# EAGLE design upper_pcb (EAGLE 9.6.2)
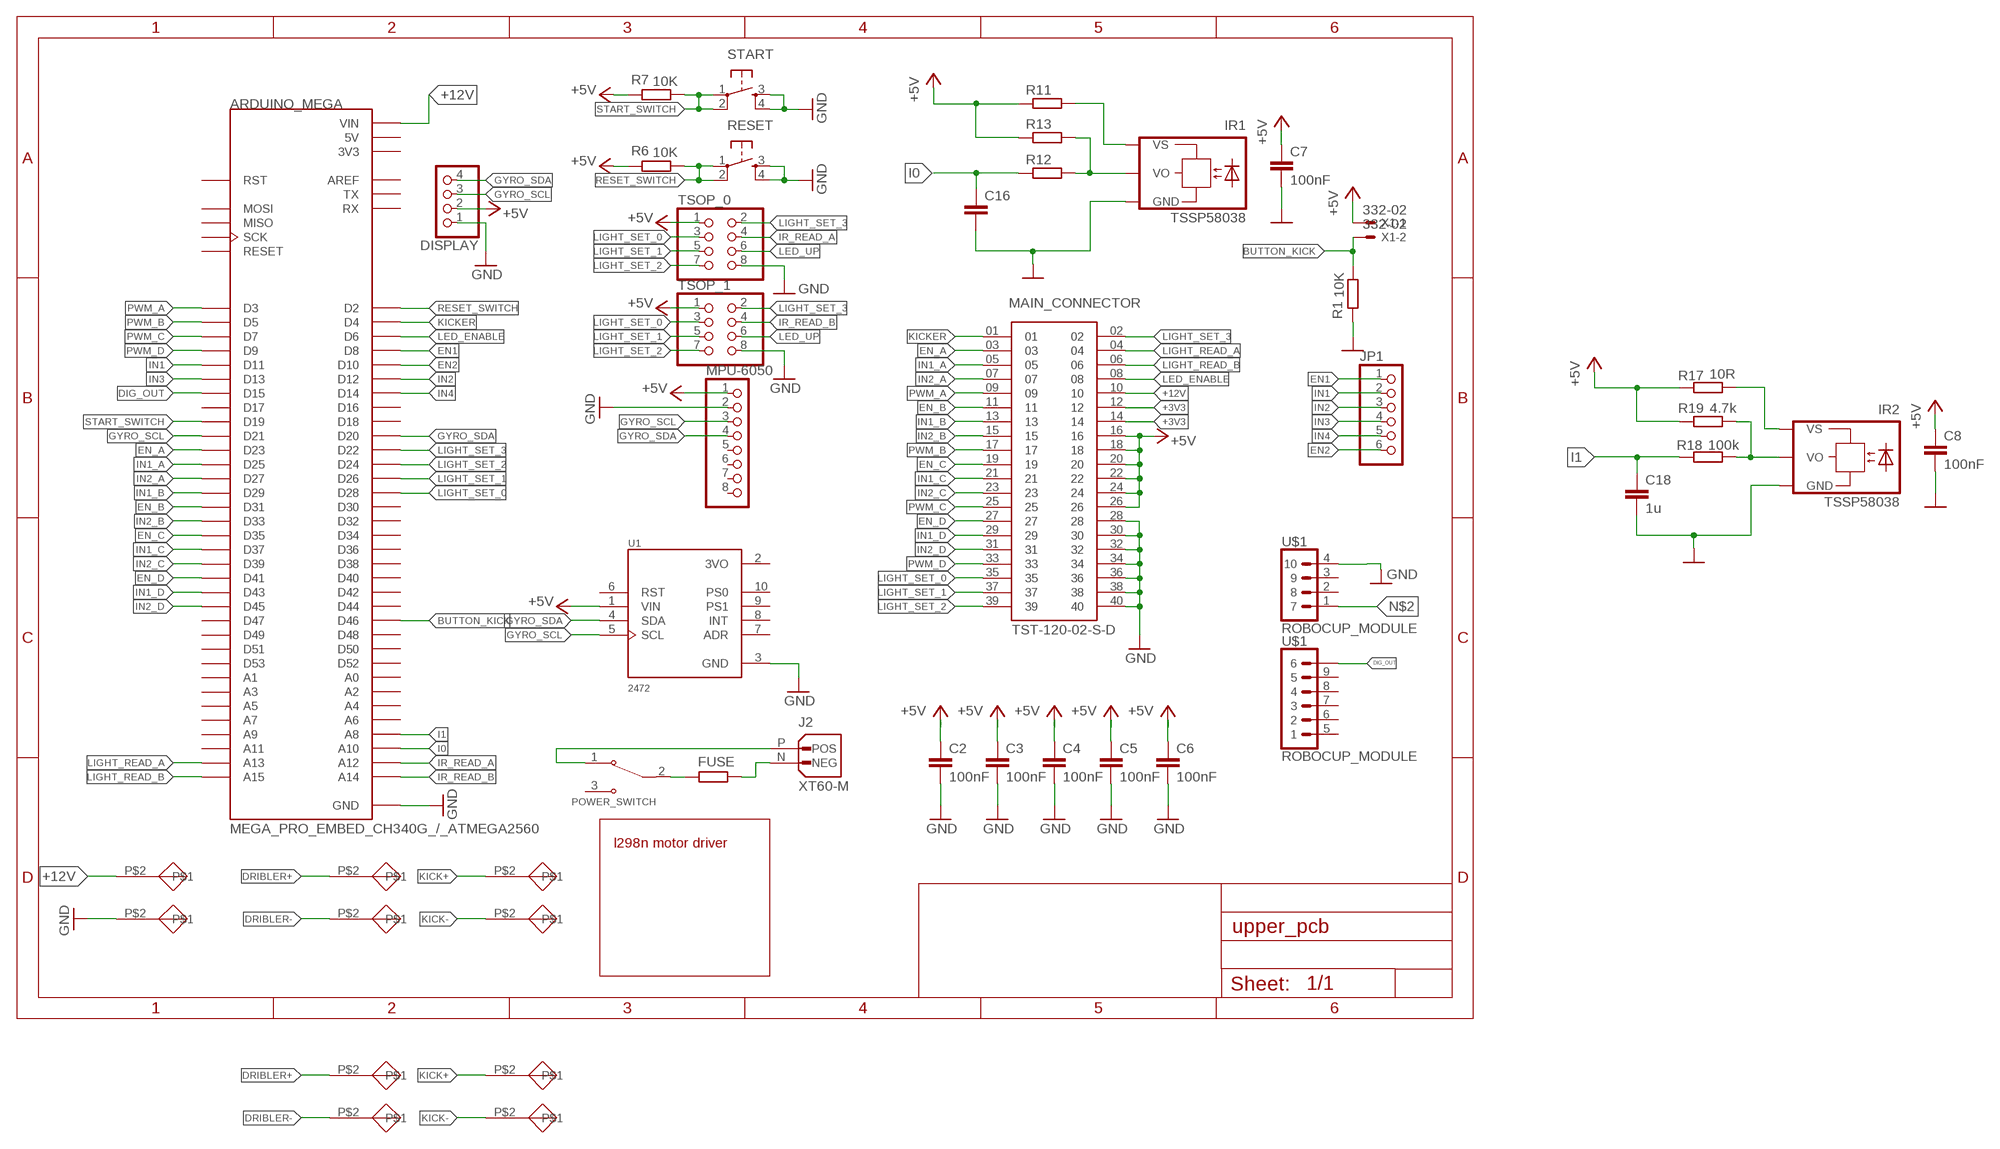
[diagram p0: schematic, sheet 1]

## Parts
ARDUINO_MEGA  MEGA_PRO_EMBED_CH340G_/_ATMEGA2560  [MODULE_MEGA_PRO_EMBED_CH340G_/_ATMEGA2560]
C2  100nF  C-EUC0805  [C0805]
C3  100nF  C-EUC0805  [C0805]
C4  100nF  C-EUC0805  [C0805]
C5  100nF  C-EUC0805  [C0805]
C6  100nF  C-EUC0805  [C0805]
C7  100nF  C-EUC0805  [C0805]
C8  100nF  C-EUC0805  [C0805]
C16  C-EUC0805  [C0805]
C18  1u  C-EUC0805  [C0805]
DISPLAY  PINHD-1X4  [1X04]
FUSE  R-EU_R1206  [R1206]
IR1  TSSP58038  TSOP4038  [TSOP]
IR2  TSSP58038  TSOP4038  [TSOP]
J2  XT60-M  [AMASS_XT60-M]
JP1  PINHD-1X6  [1X06]
MAIN_CONNECTOR  TST-120-02-S-D  [SAMTEC_TST-120-02-S-D]
MPU-6050  PINHD-1X8  [1X08]
POWER_SWITCH  100SP1T1B4M2QE  [SW_100SP1T1B4M2QE]
R1  10K  R-EU_R1206  [R1206]
R6  10K  R-EU_R1206  [R1206]
R7  10K  R-EU_R1206  [R1206]
R11  R-EU_R0805  [R0805]
R12  R-EU_R0805  [R0805]
R13  R-EU_R0805  [R0805]
R17  10R  R-EU_R0805  [R0805]
R18  100k  R-EU_R0805  [R0805]
R19  4.7k  R-EU_R0805  [R0805]
RESET  DTSM-6  [DTSM-6]
START  DTSM-6  [DTSM-6]
TSOP_0  PINHD-2X4  [2X04]
TSOP_1  PINHD-2X4  [2X04]
U1  2472  [MODULE_2472]
U$1  ROBOCUP_MODULE  [ROBOCUP_MODULE]
U$2  L298NMOTORDRIVER  [L298NMOTORDRIVER]
U$3  PAD_MOTORS  [PAD_MOTORS]
U$4  PAD_MOTORS  [PAD_MOTORS]
U$5  PAD_MOTORS  [PAD_MOTORS]
U$6  PAD_MOTORS  [PAD_MOTORS]
U$7  PAD_MOTORS  [PAD_MOTORS]
U$8  PAD_MOTORS  [PAD_MOTORS]
U$9  PAD_MOTORS  [PAD_MOTORS]
U$10  PAD_MOTORS  [PAD_MOTORS]
U$11  PAD_MOTORS  [PAD_MOTORS]
U$12  PAD_MOTORS  [PAD_MOTORS]
X1  332-02  [332-02]

## Nets
+3V3: MAIN_CONNECTOR.12 MAIN_CONNECTOR.14
+5V: C2.1 C3.1 C4.1 C5.1 C6.1 C7.1 C8.1 DISPLAY.2 MAIN_CONNECTOR.16 MAIN_CONNECTOR.18 MAIN_CONNECTOR.20 MAIN_CONNECTOR.22 MAIN_CONNECTOR.24 MAIN_CONNECTOR.26 MPU-6050.1 R6.2 R7.2 R11.1 R13.1 R17.1 R19.1 TSOP_0.1 TSOP_1.1 U1.1(VIN) X1.1
+12V: ARDUINO_MEGA.VIN_1(VIN) ARDUINO_MEGA.VIN_2(VIN) MAIN_CONNECTOR.10 U$7.P$2
BUTTON_KICK: ARDUINO_MEGA.D46 R1.1 X1.2
DIG_OUT: ARDUINO_MEGA.D15 U$1.10
DRIBLER+: U$5.P$2 U$11.P$2
DRIBLER-: U$6.P$2 U$12.P$2
EN1: ARDUINO_MEGA.D8 JP1.1
EN2: ARDUINO_MEGA.D10 JP1.6
EN_A: ARDUINO_MEGA.D23 MAIN_CONNECTOR.03
EN_B: ARDUINO_MEGA.D31 MAIN_CONNECTOR.11
EN_C: ARDUINO_MEGA.D35 MAIN_CONNECTOR.19
EN_D: ARDUINO_MEGA.D41 MAIN_CONNECTOR.27
GND: ARDUINO_MEGA.GND_1(GND) ARDUINO_MEGA.GND_2(GND) ARDUINO_MEGA.GND_3(GND) C2.2 C3.2 C4.2 C5.2 C6.2 C7.2 C8.2 C16.2 C18.2 DISPLAY.1 IR1.GND IR2.GND MAIN_CONNECTOR.28 MAIN_CONNECTOR.30 MAIN_CONNECTOR.32 MAIN_CONNECTOR.34 MAIN_CONNECTOR.36 MAIN_CONNECTOR.38 MAIN_CONNECTOR.40 MPU-6050.2 R1.2 RESET.3 RESET.4 START.3 START.4 TSOP_0.8 TSOP_1.8 U1.3(GND) U$1.4 U$8.P$2
GYRO_SCL: ARDUINO_MEGA.D21 DISPLAY.3 MPU-6050.3 U1.5(SCL)
GYRO_SDA: ARDUINO_MEGA.D20 DISPLAY.4 MPU-6050.4 U1.4(SDA)
I0: ARDUINO_MEGA.A10 C16.1 R12.1
I1: ARDUINO_MEGA.A8 C18.1 R18.1
IN1: ARDUINO_MEGA.D11 JP1.2
IN1_A: ARDUINO_MEGA.D25 MAIN_CONNECTOR.05
IN1_B: ARDUINO_MEGA.D29 MAIN_CONNECTOR.13
IN1_C: ARDUINO_MEGA.D37 MAIN_CONNECTOR.21
IN1_D: ARDUINO_MEGA.D43 MAIN_CONNECTOR.29
IN2: ARDUINO_MEGA.D12 JP1.3
IN2_A: ARDUINO_MEGA.D27 MAIN_CONNECTOR.07
IN2_B: ARDUINO_MEGA.D33 MAIN_CONNECTOR.15
IN2_C: ARDUINO_MEGA.D39 MAIN_CONNECTOR.23
IN2_D: ARDUINO_MEGA.D45 MAIN_CONNECTOR.31
IN3: ARDUINO_MEGA.D13 JP1.4
IN4: ARDUINO_MEGA.D14 JP1.5
IR_READ_A: ARDUINO_MEGA.A12 TSOP_0.4
IR_READ_B: ARDUINO_MEGA.A14 TSOP_1.4
KICK+: U$3.P$2 U$9.P$2
KICK-: U$4.P$2 U$10.P$2
KICKER: ARDUINO_MEGA.D4 MAIN_CONNECTOR.01
LED_ENABLE: ARDUINO_MEGA.D6 MAIN_CONNECTOR.08
LED_UP: TSOP_0.6 TSOP_1.6
LIGHT_READ_A: ARDUINO_MEGA.A13 MAIN_CONNECTOR.04
LIGHT_READ_B: ARDUINO_MEGA.A15 MAIN_CONNECTOR.06
LIGHT_SET_0: ARDUINO_MEGA.D28 MAIN_CONNECTOR.35 TSOP_0.3 TSOP_1.3
LIGHT_SET_1: ARDUINO_MEGA.D26 MAIN_CONNECTOR.37 TSOP_0.5 TSOP_1.5
LIGHT_SET_2: ARDUINO_MEGA.D24 MAIN_CONNECTOR.39 TSOP_0.7 TSOP_1.7
LIGHT_SET_3: ARDUINO_MEGA.D22 MAIN_CONNECTOR.02 TSOP_0.2 TSOP_1.2
N$1: FUSE.2 POWER_SWITCH.2
N$2: J2.P(POS) POWER_SWITCH.1 U$1.1
N$3: FUSE.1 J2.N(NEG)
N$9: IR1.VS R11.2
N$11: IR2.VS R17.2
N$23: IR1.VO R12.2 R13.2
N$27: IR2.VO R18.2 R19.2
PWM_A: ARDUINO_MEGA.D3 MAIN_CONNECTOR.09
PWM_B: ARDUINO_MEGA.D5 MAIN_CONNECTOR.17
PWM_C: ARDUINO_MEGA.D7 MAIN_CONNECTOR.25
PWM_D: ARDUINO_MEGA.D9 MAIN_CONNECTOR.33
RESET_SWITCH: ARDUINO_MEGA.D2 R6.1 RESET.1 RESET.2
START_SWITCH: ARDUINO_MEGA.D19 R7.1 START.1 START.2
Unconnected: ARDUINO_MEGA.A0 ARDUINO_MEGA.A1 ARDUINO_MEGA.A2 ARDUINO_MEGA.A3 ARDUINO_MEGA.A4 ARDUINO_MEGA.A5 ARDUINO_MEGA.A6 ARDUINO_MEGA.A7 ARDUINO_MEGA.A9 ARDUINO_MEGA.A11 ARDUINO_MEGA.AREF ARDUINO_MEGA.D16 ARDUINO_MEGA.D17 ARDUINO_MEGA.D18 ARDUINO_MEGA.D30 ARDUINO_MEGA.D32 ARDUINO_MEGA.D34 ARDUINO_MEGA.D36 ARDUINO_MEGA.D38 ARDUINO_MEGA.D40 ARDUINO_MEGA.D42 ARDUINO_MEGA.D44 ARDUINO_MEGA.D47 ARDUINO_MEGA.D48 ARDUINO_MEGA.D49 ARDUINO_MEGA.D50 ARDUINO_MEGA.D51 ARDUINO_MEGA.D52 ARDUINO_MEGA.D53 ARDUINO_MEGA.MISO ARDUINO_MEGA.MOSI ARDUINO_MEGA.RESET ARDUINO_MEGA.RST ARDUINO_MEGA.RX ARDUINO_MEGA.SCK ARDUINO_MEGA.TX MPU-6050.5 MPU-6050.6 MPU-6050.7 MPU-6050.8 POWER_SWITCH.3 U1.6(RST) U1.7(ADR) U1.8(INT) U1.9(PS1) U1.10(PS0) U$1.2 U$1.3 U$1.5 U$1.6 U$1.7 U$1.8 U$1.9

## Power pins joined to a net without a drawn wire
3V3: ARDUINO_MEGA.3V3_1(3V3) ARDUINO_MEGA.3V3_2(3V3)
3VO: U1.2(3VO)
5V: ARDUINO_MEGA.5V_1(5V) ARDUINO_MEGA.5V_2(5V) ARDUINO_MEGA.5V_3(5V)

## Library data of the parts
ARDUINO_MEGA = MEGA_PRO_EMBED_CH340G___ATMEGA2560:MEGA_PRO_EMBED_CH340G_/_ATMEGA2560: Mega 2560 PRO (Embed) CH340G/ATmega2560-16AU Check availability <https://pricing.snapeda.com/parts/Mega%20Pro%20Embed%20CH340G%20/%20ATmega2560/Robotdyn/view-part?ref=eda>; AVAILABILITY: Not in stock; MF: Robotdyn; MP: Mega Pro Embed CH340G / ATmega2560; PACKAGE: None; PRICE: None
C2-C8 C16 C18 = rcl:C-EU: CAPACITOR, European symbol; SPICEPREFIX: C
DISPLAY = pinhead:PINHD-1X4: PIN HEADER
FUSE R1 R6 R7 R11-R13 R17-R19 = rcl:R-EU_: RESISTOR, European symbol; SPICEPREFIX: R
IR1 IR2 = TSOP4038:TSOP4038: TSOP4038 IR Receiver Module Source: http://www.vishay.com/docs/81926/tsop4038.pdf Check availability <https://pricing.snapeda.com/parts/TSOP4038/Vishay/view-part?ref=eda>; AVAILABILITY: In Stock; DESCRIPTION: Remote Receiver Sensor, 38.0kHz 30m Through Hole; MF: Vishay; MP: TSOP4038; PACKAGE: None; PRICE: None; PURCHASE-URL: https://pricing.snapeda.com/search/part/TSOP4038/?ref=eda
J2 = XT60-M:XT60-M: Check availability <https://pricing.snapeda.com/parts/XT60-M/AMASS/view-part?ref=eda>; AVAILABILITY: Not in stock; DESCRIPTION: Plug; DC supply; XT60; male; PIN: 2; for cable; soldered; 30A; 500V; MF: AMASS; MP: XT60-M; PACKAGE: Package; PRICE: None
JP1 = adafruit:PINHD-1X6: PIN HEADER
MAIN_CONNECTOR = TST-120-02-S-D:TST-120-02-S-D: Check availability <https://pricing.snapeda.com/parts/TST-120-02-S-D-20/Samtec/view-part?ref=eda>; AVAILABILITY: In Stock; DESCRIPTION: Connector Header Through Hole 40 position 0.100 (2.54mm); MF: Samtec; MP: TST-120-02-S-D-20; PACKAGE: None; PRICE: None; PURCHASE-URL: https://pricing.snapeda.com/search/part/TST-120-02-S-D-20/?ref=eda
MPU-6050 = pinhead:PINHD-1X8: PIN HEADER
POWER_SWITCH = 100SP1T1B4M2QE:100SP1T1B4M2QE: Toggle Switch SPDT Through Hole Check availability <https://pricing.snapeda.com/parts/100SP1T1B4M2QE/E-Switch/view-part?ref=eda>; AVAILABILITY: In Stock; DESCRIPTION: Toggle Switch SPDT Through Hole; MF: E-Switch; MP: 100SP1T1B4M2QE; PACKAGE: None; PRICE: None; PURCHASE-URL: https://pricing.snapeda.com/search/part/100SP1T1B4M2QE/?ref=eda
RESET START = switch-tact:DTSM-6
TSOP_0 TSOP_1 = pinhead:PINHD-2X4: PIN HEADER
U1 = 2472:2472: Check availability <https://pricing.snapeda.com/parts/2472/Adafruit/view-part?ref=eda>; AVAILABILITY: In Stock; CHECK_PRICES: https://www.snapeda.com/parts/2472/Adafruit+Industries/view-part/?ref=eda; DESCRIPTION: Adafruit 9-DOF Absolute Orientation IMU Fusion Breakout - BNO055 | Adafruit Industries 2472; MF: Adafruit; MP: 2472; PACKAGE: Non-Standard Adafruit; PRICE: None; PURCHASE-URL: https://www.snapeda.com/api/url_track_click_mouser/?unipart_id=6348449&manufacturer=Adafruit&part_name=2472&search_term=adafruit 9-dof; SNAPEDA_LINK: https://www.snapeda.com/parts/2472/Adafruit+Industries/view-part/?ref=snap
U$1 = ROBOCUP_MODULE:ROBOCUP_MODULE
U$2 = l298n motor driver:L298NMOTORDRIVER
U$3-U$12 = PAD_MOTORS:PAD_MOTORS
X1 = con-garry:332-02: 2 Pin - 2mm Dual Row Source: www.mpe-connector.de / garry_shortform_2012.pdf

## Board
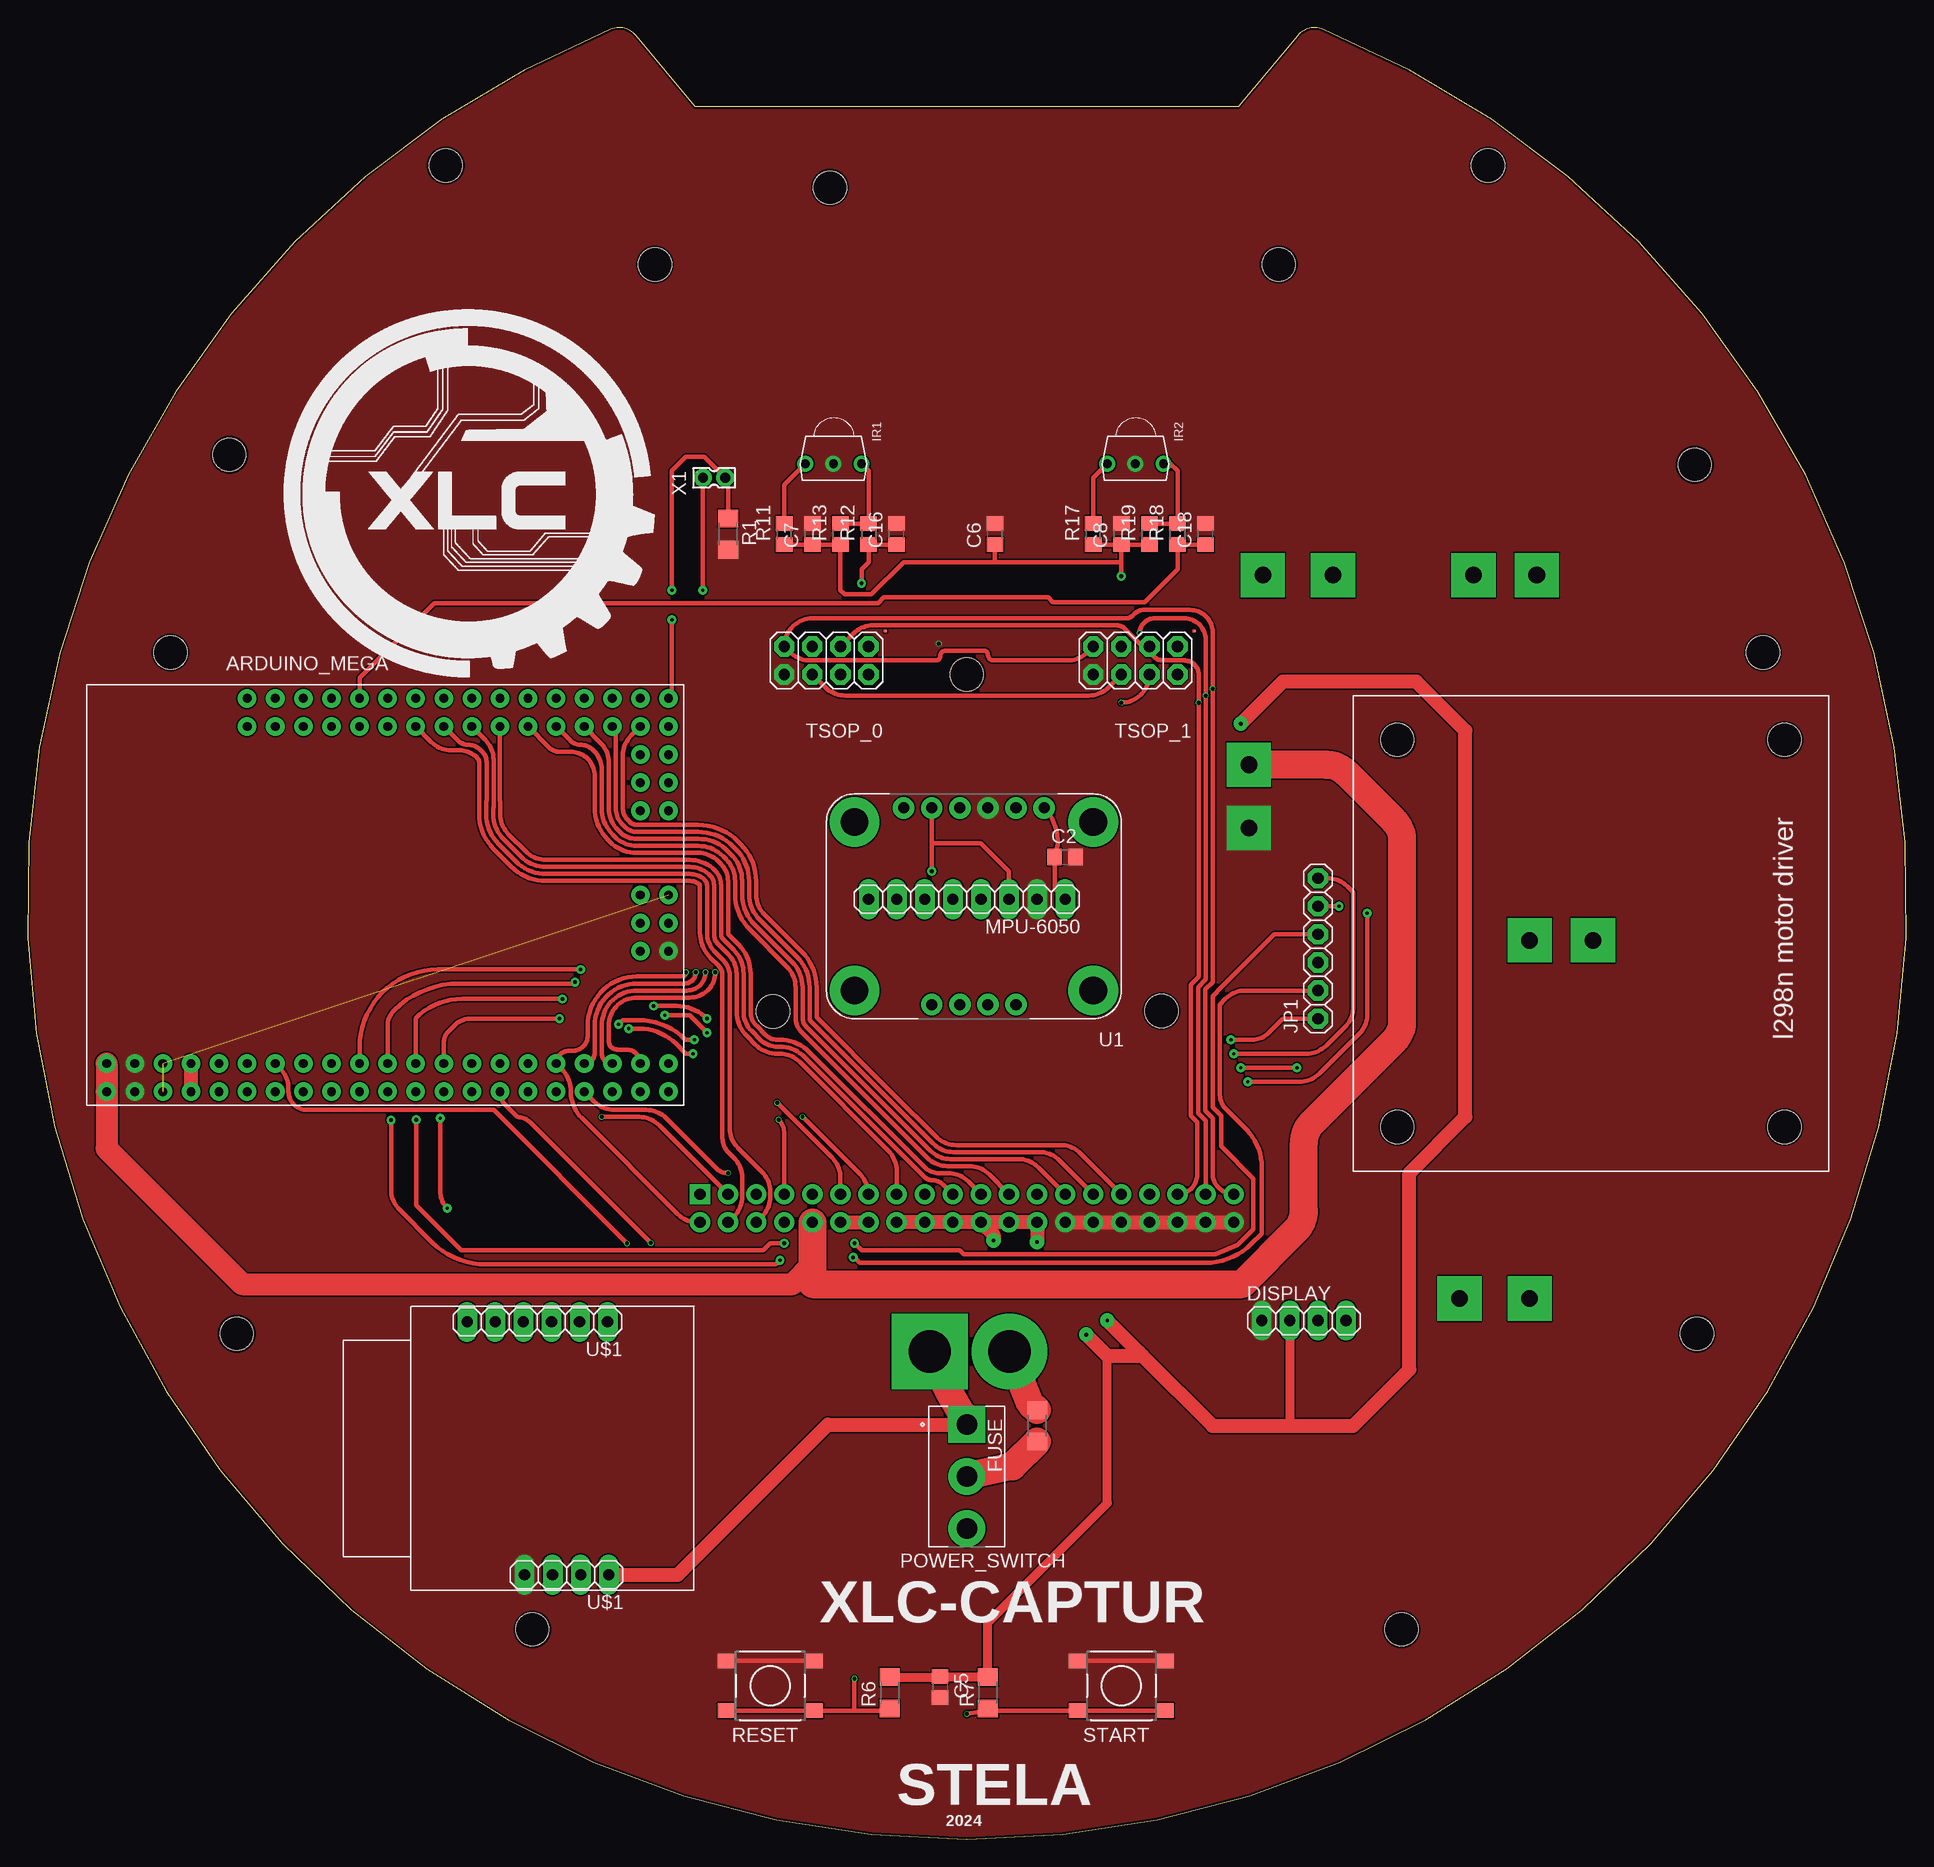
[diagram p1: board, top side]
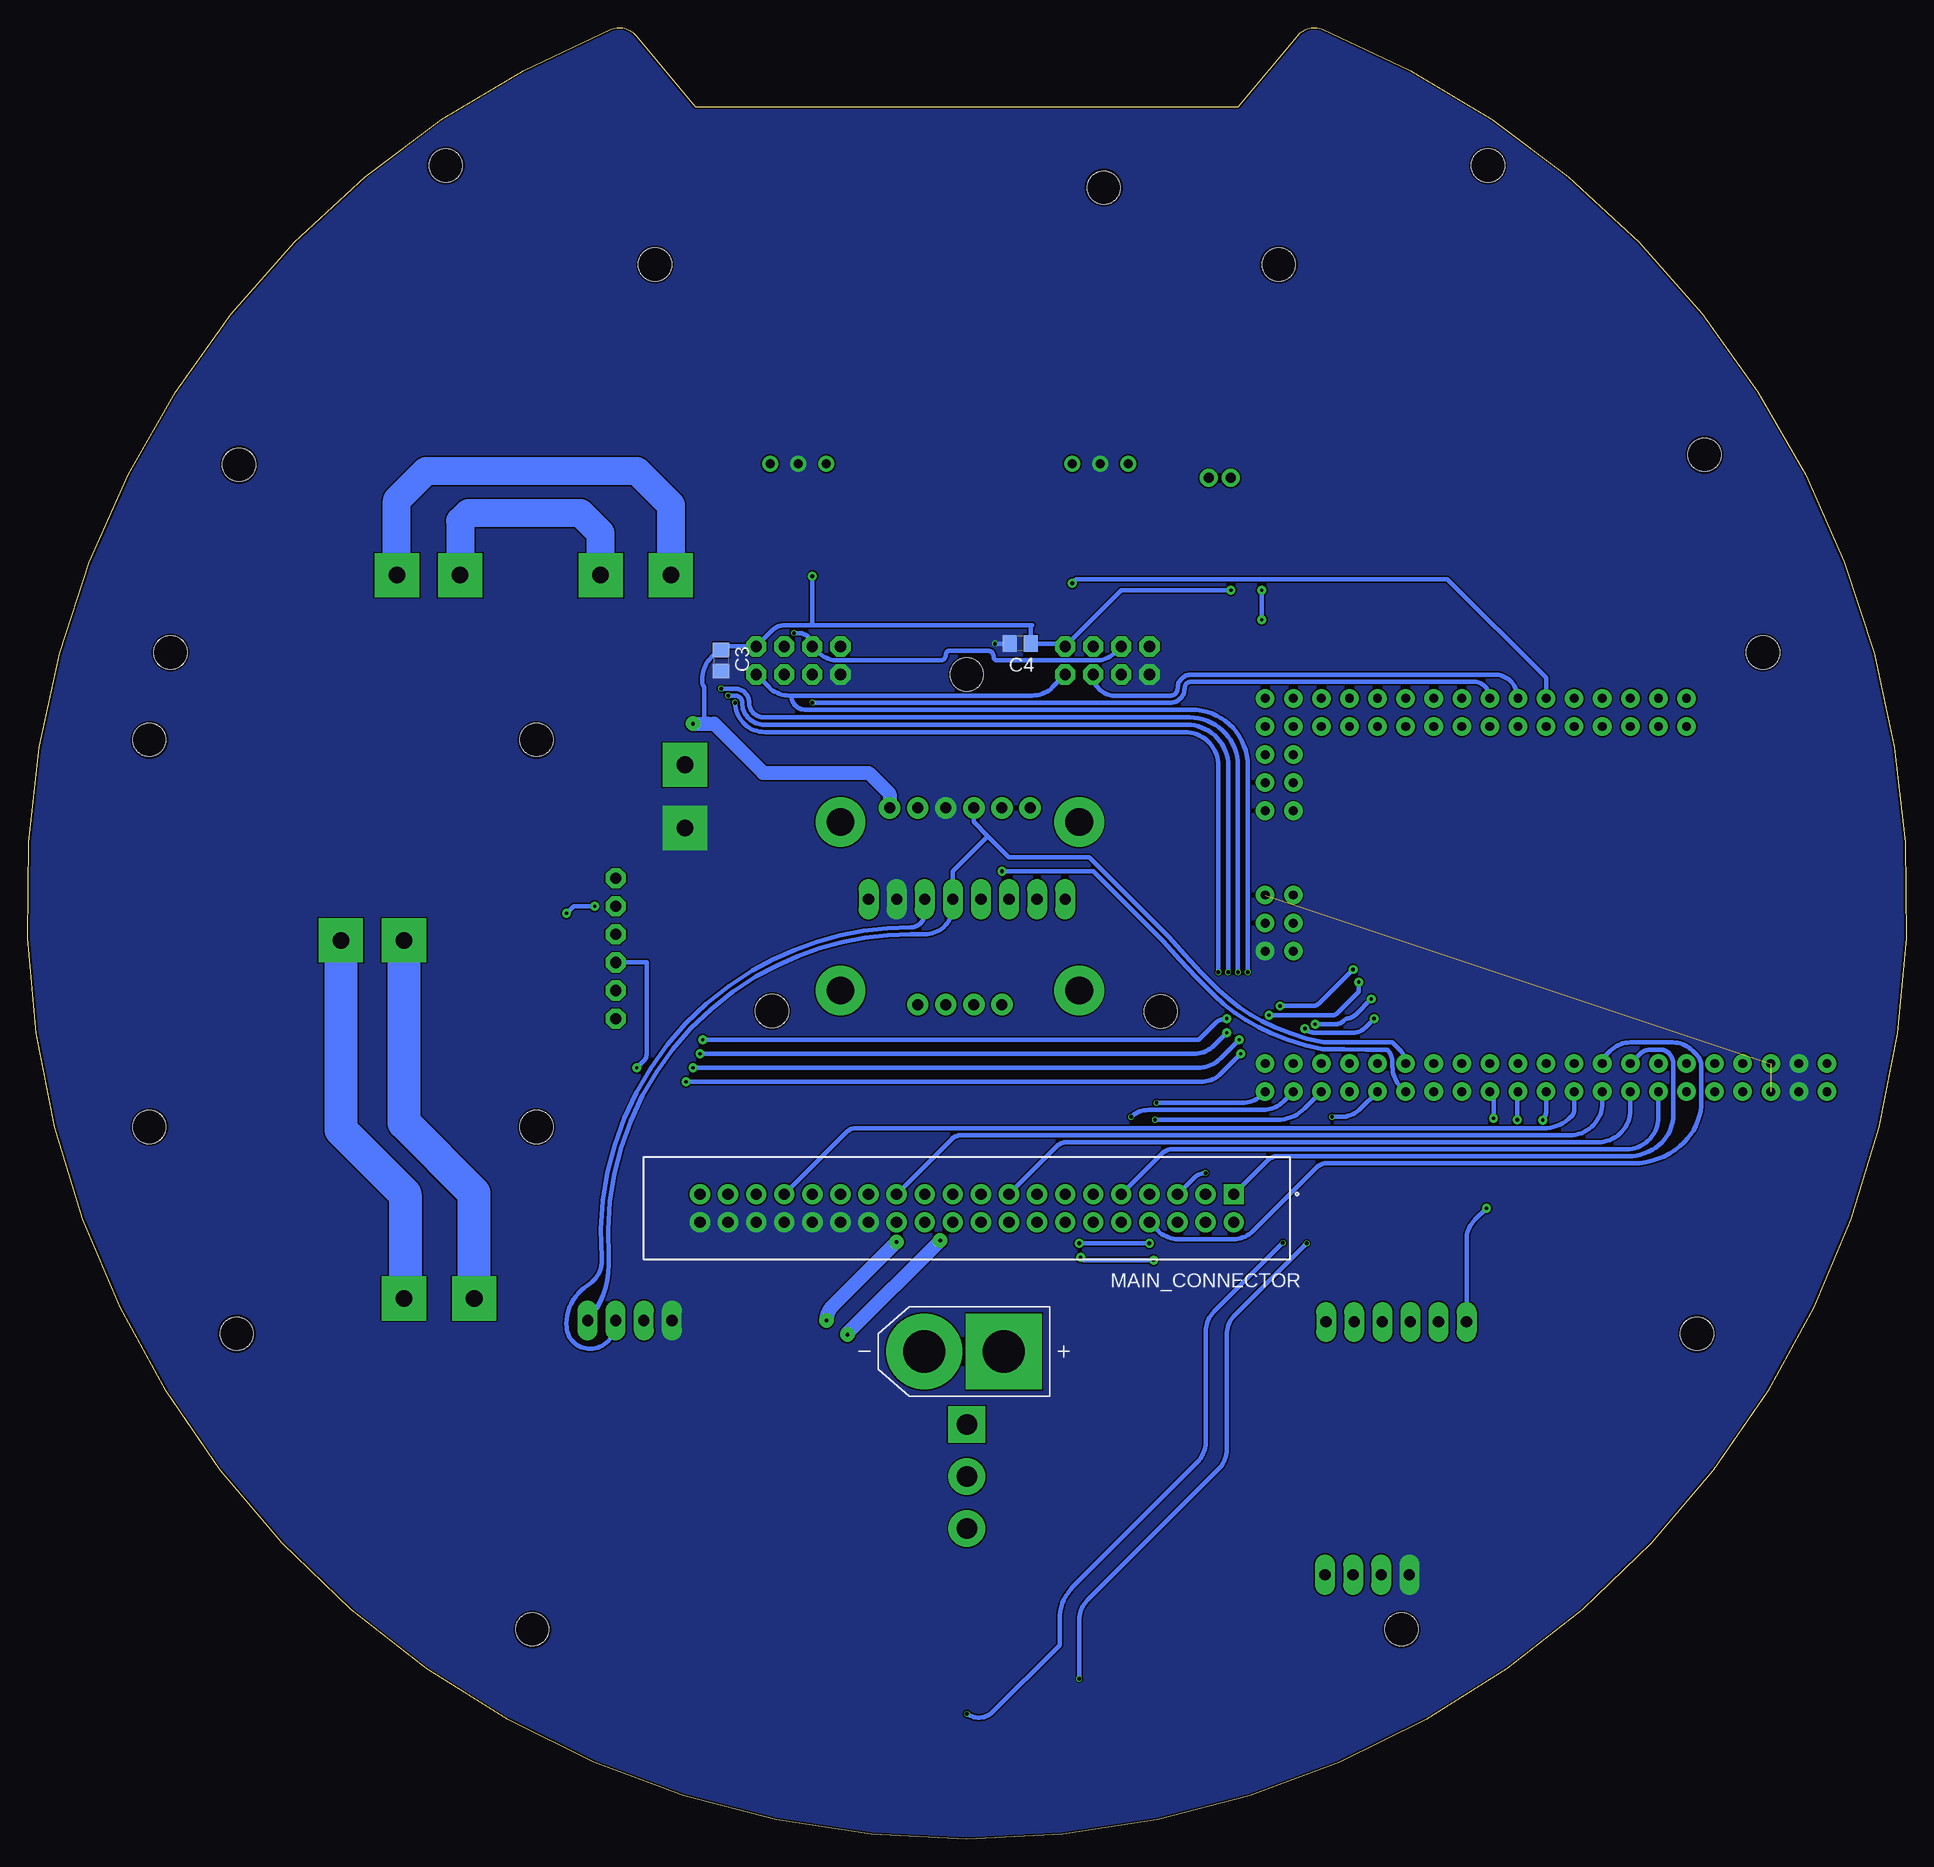
[diagram p2: board, bottom side, seen from below]

Size 169.86 x 163.81 mm. Coordinates in mm from the lower left corner, seen from the top.
Outline: 60.37,156.65 55.03,163.09 arc73 52.73,163.67 arc315 117.13,163.67 arc73 114.83,163.09 109.48,156.65 60.37,156.65
Copper layers (1*16): Top 0.035mm / dielectric 1.6mm / Bottom 0.035mm
Design rules "jlc_pcb": minimum track width 5mil, minimum drill 0.3mm, track to track 5mil, track to pad 5mil, pad to pad 5mil, via to via 5mil, smd to smd 5mil, copper to edge 0.2mm, drill to drill 6mil, minimum pad ring 10mil, minimum via ring 3mil, stop-mask expansion 4mil, vias tented up to drill 0mil, thermal gap 10mil
Holes 3 mm at 72.55,149.35 56.72,142.4 113.13,142.4 150.75,124.29 37.81,151.36 132.05,151.36 18.24,125.19 18.91,45.71 45.64,18.98 124.22,18.98 150.94,45.71 84.93,105.32 67.39,74.86 102.54,74.9 12.93,107.32 156.93,107.32

### Footprints (pad centres in the part's own frame; a part is rotated, then mirrored left to right if it is on the bottom)
MODULE_MEGA_PRO_EMBED_CH340G_/_ATMEGA2560 = drill 0.8 pad 1.676: 3V3_1 -17.58,-17.78; 3V3_2 -17.58,-15.24; 5V_1 -20.12,-17.78; 5V_2 -20.12,-15.24; 5V_3 25.6,0; A0 -12.5,17.78; A1 -12.5,15.24; A2 -9.96,17.78; A3 -9.96,15.24; A4 -7.42,17.78; A5 -7.42,15.24; A6 -4.88,17.78; A7 -4.88,15.24; A8 -2.34,17.78; A9 -2.34,15.24; A10 0.2,17.78; A11 0.2,15.24; A12 2.74,17.78; A13 2.74,15.24; A14 5.28,17.78; A15 5.28,15.24; AREF -15.04,-15.24; D2 -9.96,-15.24; D3 -9.96,-17.78; D4 -7.42,-15.24; D5 -7.42,-17.78; D6 -4.88,-15.24; D7 -4.88,-17.78; D8 -2.34,-15.24; D9 -2.34,-17.78; D10 0.2,-15.24; D11 0.2,-17.78; D12 2.74,-15.24; D13 2.74,-17.78; D14 5.28,-15.24; D15 5.28,-17.78; D16 7.82,-15.24; D17 7.82,-17.78; D18 10.36,-15.24; D19 10.36,-17.78; D20 12.9,-15.24; D21 12.9,-17.78; D22 15.44,-15.24; D23 15.44,-17.78; D24 17.98,-15.24; D25 17.98,-17.78; D26 20.52,-15.24; D27 20.52,-17.78; D28 23.06,-15.24; D29 23.06,-17.78; D30 25.6,-15.24; D31 25.6,-17.78; D32 7.82,17.78; D33 7.82,15.24; D34 10.36,17.78; D35 10.36,15.24; D36 12.9,17.78; D37 12.9,15.24; D38 15.44,17.78; D39 15.44,15.24; D40 17.98,17.78; D41 17.98,15.24; D42 20.52,17.78; D43 20.52,15.24; D44 23.06,17.78; D45 23.06,15.24; D46 25.6,17.78; D47 25.6,15.24; D48 25.6,12.7; D49 23.06,12.7; D50 25.6,10.16; D51 23.06,10.16; D52 25.6,7.62; D53 23.06,7.62; GND_1 -22.66,-17.78; GND_2 -22.66,-15.24; GND_3 25.6,-5.08; MISO 23.06,0; MOSI 25.6,-2.54; RESET 23.06,-5.08; RST -15.04,-17.78; RX -12.5,-15.24; SCK 23.06,-2.54; TX -12.5,-17.78; VIN_1 -25.2,-17.78; VIN_2 -25.2,-15.24
C0805 = smd 1.3 x 1.5: 1 -0.95,0; 2 0.95,0
1X04 = drill 1.016 long: 1 -3.81,0; 2 -1.27,0; 3 1.27,0; 4 3.81,0
R1206 = smd 1.6 x 1.803: 1 -1.422,0; 2 1.422,0
TSOP = drill 0.8: GND 0,0; VO 0,-2.54; VS 0,2.54
AMASS_XT60-M = drill 3.81 pad 5.08: N 3.6,0 | drill 3.81 pad 5.08 square: P -3.6,0
1X06 = drill 1.016 octagon: 1 -6.35,0; 2 -3.81,0; 3 -1.27,0; 4 1.27,0; 5 3.81,0; 6 6.35,0
SAMTEC_TST-120-02-S-D = drill 1.02 pad 1.37 square: 01 0,0 | drill 1.02 pad 1.37: 02 0,2.54; 03 2.54,0; 04 2.54,2.54; 05 5.08,0; 06 5.08,2.54; 07 7.62,0; 08 7.62,2.54; 09 10.16,0; 10 10.16,2.54; 11 12.7,0; 12 12.7,2.54; 13 15.24,0; 14 15.24,2.54; 15 17.78,0; 16 17.78,2.54; 17 20.32,0; 18 20.32,2.54; 19 22.86,0; 20 22.86,2.54; 21 25.4,0; 22 25.4,2.54; 23 27.94,0; 24 27.94,2.54; 25 30.48,0; 26 30.48,2.54; 27 33.02,0; 28 33.02,2.54; 29 35.56,0; 30 35.56,2.54; 31 38.1,0; 32 38.1,2.54; 33 40.64,0; 34 40.64,2.54; 35 43.18,0; 36 43.18,2.54; 37 45.72,0; 38 45.72,2.54; 39 48.26,0; 40 48.26,2.54
1X08 = drill 1.016 long: 1 -8.89,0; 2 -6.35,0; 3 -3.81,0; 4 -1.27,0; 5 1.27,0; 6 3.81,0; 7 6.35,0; 8 8.89,0
SW_100SP1T1B4M2QE = drill 1.85 square: 1 0,4.7 | drill 1.85: 2 0,0; 3 0,-4.7
R0805 = smd 1.3 x 1.5: 1 -0.95,0; 2 0.95,0
DTSM-6 = smd 1.55 x 1.3: 1 -3.975,2.25; 2 3.975,2.25; 3 -3.975,-2.25; 4 3.975,-2.25
2X04 = drill 1.016 octagon: 1 -3.81,-1.27; 2 -3.81,1.27; 3 -1.27,-1.27; 4 -1.27,1.27; 5 1.27,-1.27; 6 1.27,1.27; 7 3.81,-1.27; 8 3.81,1.27 | smd 0.254 x 0.254: P$1 -5.334,-2.667
MODULE_2472 = drill 1 pad 1.93: 1 -6.35,-8.89; 2 -3.81,-8.89; 3 -1.27,-8.89; 4 1.27,-8.89; 5 3.81,-8.89; 6 6.35,-8.89; 7 3.81,8.89; 8 1.27,8.89; 9 -1.27,8.89; 10 -3.81,8.89 | drill 2.5 pad 4: SH1 -10.795,-7.62; SH2 10.795,-7.62; SH3 10.795,7.62; SH4 -10.795,7.62
ROBOCUP_MODULE = drill 1.016 long: 1 -3.81,13.97; 2 -3.81,16.51; 3 -3.81,19.05; 4 -3.81,21.59; 5 19.06,14.07; 6 19.06,16.61; 7 19.06,19.15; 8 19.06,21.69; 9 19.06,24.23; 10 19.06,26.77
L298NMOTORDRIVER = hole 3: 4,4; 4,39; 39,39; 39,4
PAD_MOTORS = drill 1.5 pad 4 square: P$2 2,2
332-02 = drill 0.9 pad 1.27: 1 0,-1; 2 0,1

### Placement (x,y rotation side)
ARDUINO_MEGA  32.35,85.38 0 top
C2  93.82,88.81 0 top
C3  107.15,106.59 270 bottom
C4  80.1,108.11 180 bottom
C5  82.51,13.75 270 top
C6  87.47,118.02 90 top
C7  70.96,118.02 90 top
C8  98.9,118.02 90 top
C16  78.58,118.02 90 top
C18  106.52,118.02 90 top
DISPLAY  115.41,46.9 0 top
FUSE  91.28,37.38 270 top
IR1  72.86,124.37 90 top
IR2  100.17,124.37 90 top
J2  85.18,44.11 180 bottom
JP1  116.68,80.56 90 top
MAIN_CONNECTOR  60.8,58.33 180 bottom
MPU-6050  84.93,85 180 top
POWER_SWITCH  84.93,32.8 0 top
R1  63.34,118.02 270 top
R6  77.94,13.25 90 top
R7  86.83,13.25 90 top
R11  68.42,118.02 90 top
R12  76.04,118.02 90 top
R13  73.5,118.02 90 top
R17  96.36,118.02 90 top
R18  103.98,118.02 90 top
R19  101.44,118.02 90 top
RESET  67.15,13.88 180 top
START  98.9,13.88 180 top
TSOP_0  72.23,106.59 180 top
TSOP_1  100.17,106.59 180 top
U1  85.56,84.37 180 top
U$1  66.51,27.72 90 top
U$2  119.85,103.42 270 top
U$3  139.54,79.29 0 top
U$4  133.82,79.29 0 top
U$5  134.46,112.31 0 top
U$6  116.04,112.31 0 top
U$7  108.42,95.16 0 top
U$8  108.42,89.45 0 top
U$9  133.82,46.9 0 top
U$10  127.47,46.9 0 top
U$11  109.69,112.31 0 top
U$12  128.74,112.31 0 top
X1  62.07,123.1 270 top

### Tracks (layer width: path | path; a pad name or v marks a point on that pad's centre or on a via)
3V3
  Top 1.27: ARDUINO_MEGA.3V3_2 ARDUINO_MEGA.3V3_1
5V  (2 unrouted)
+3V3
  Top 1.27: MAIN_CONNECTOR.12 MAIN_CONNECTOR.14
+5V  (via drill 0.3 pad 0.8, 0.3 pad 1.3, 0.35 pad 0.8, 0.35 pad 1.3)
  Top 0.406: R6.2 82.39,14.67 | 82.39,14.67 R7.2 | C5.1 82.39,14.67 | U1.1 arc-66 C2.1 92.87,88.78 | 92.93,88.18 92.87,88.78 | R11.1 C7.1 R13.1 73.5,112.94 73.88,112.56 76.29,112.56 79.21,115.48 87.47,115.48 | R17.1 C8.1 | C8.1 R19.1 | v98.9,114.21 98.9,115.48 | 98.9,115.48 C8.1 | 98.9,115.48 87.47,115.48 | 87.47,115.48 C6.1 | MPU-6050.1 92.87,85.95 92.87,88.78 | v61.05,112.94 61.05,123.08 X1.1
  Top 0.813: R6.2 82.39,14.67 | C5.1 86.75,14.7 arc-45 R7.2 86.83,19.6 97.63,30.39 97.63,43.73 | DISPLAY.2 114.14,37.38
  Top 1.27: MAIN_CONNECTOR.22 MAIN_CONNECTOR.24 MAIN_CONNECTOR.26 v91.28,54.01 | MAIN_CONNECTOR.22 MAIN_CONNECTOR.20 MAIN_CONNECTOR.18 MAIN_CONNECTOR.16 | v97.63,46.9 100.48,44.04 100.17,43.73 | MAIN_CONNECTOR.22 87.34,54.65 v87.34,54.14 | v95.72,45.63 97.63,43.73 100.17,43.73 | 100.17,43.73 100.8,43.73 107.15,37.38 114.14,37.38 119.85,37.38 124.93,42.46 124.93,60.24 130.01,65.32 130.01,100.24 125.57,104.69 113.5,104.69 v109.69,100.88
  Bottom 0.406: 78.99,109.77 79.21,109.77 | 98.9,109.77 100.27,109.77 101.45,109.77 arc-45 102.51,109.33 TSOP_1.1 106.38,107.86 arc-45 C3.1 107.64,107.21 arc-66 108.81,104.36 108.68,104.23 108.68,100.88 | 98.9,109.77 79.21,109.77 | 79.21,109.77 79.15,109.7 C4.1 76.65,108.11 arc45 TSOP_0.1 70.96,112.94 v61.05,112.94 | 98.9,109.77 v98.9,114.21
  Bottom 1.27: v91.28,54.01 97.09,48.2 arc-45 v97.63,46.9 | v87.34,54.14 95.72,45.76 v95.72,45.63 | v109.69,100.88 108.68,100.88 108.42,100.88 107.79,100.88 103.34,96.43 93.82,96.43 91.91,94.53 U1.1
+12V
  Top 2: ARDUINO_MEGA.VIN_2 ARDUINO_MEGA.VIN_1 7.15,62.45 19.4,50.2 69.18,50.2 70.96,51.98 70.96,54.52 MAIN_CONNECTOR.10
  Top 2.54: MAIN_CONNECTOR.10 70.96,54.52 70.96,50.2 109.82,50.2 114.66,55.05 arc45 115.41,56.84 115.41,62.99 arc-45 116.15,64.79 123.55,72.19 arc45 124.3,73.99 124.3,90.3 arc45 123.55,92.09 119.23,96.42 arc45 117.44,97.16 U$7.P$2
BUTTON_KICK  (via drill 0.3 pad 0.8)
  Top 0.406: R1.1 63.34,122.83 X1.2 61.16,125.01 59.53,125.01 58.26,123.74 v58.26,112.94 | v58.26,110.27 58.26,103.47 ARDUINO_MEGA.D46
  Bottom 0.406: v58.26,112.94 v58.26,110.27
DIG_OUT  (via drill 0.3 pad 0.8)
  Top 0.406: v37.94,57.06 arc-45 37.3,58.59 v37.3,65.19
  Bottom 0.406: U$1.10 39.74,54.2 arc45 39,56 v37.94,57.06 | v37.3,65.19 37.3,66.81 arc-45 ARDUINO_MEGA.D15
DRIBLER+
  Bottom 2.54: U$5.P$2 136.46,121.1 133.82,123.74 114.77,123.74 111.69,120.66 U$11.P$2
DRIBLER-
  Bottom 2.54: U$6.P$2 118.04,118.12 119.85,119.93 130.01,119.93 130.74,119.2 U$12.P$2
EN1  (via drill 0.3 pad 0.8)
  Top 0.406: ARDUINO_MEGA.D8 30.01,71.58 arc-45 32.08,76.58 arc-45 37.08,78.65 v50,78.65 | v56.61,75.35 58.67,75.35 arc-45 v61.43,74.21 | v108.8,72.3 110.73,72.3 arc45 112.21,72.92 113.5,74.21 JP1.1
  Bottom 0.406: v50,78.65 53.07,75.58 arc45 53.64,75.35 v56.61,75.35 | v61.43,74.21 arc-45 62.52,73.76 63.97,72.3 v108.8,72.3
EN2  (via drill 0.3 pad 0.8)
  Top 0.406: ARDUINO_MEGA.D10 32.55,73.52 arc-45 33.15,74.97 arc-45 38.98,77.38 49.37,77.38 v49.49,77.51 | v57.61,74.51 57.63,74.49 59.88,74.49 v61.43,72.94 | JP1.6 117.53,86.91 arc-45 119.33,86.16 119.85,85.64 119.85,75.1 arc-45 119.22,73.57 117.42,71.77 arc-45 115.63,71.03 v109.06,71.03
  Bottom 0.406: v49.49,77.51 49.49,76.62 51.44,74.68 arc45 51.84,74.51 v57.61,74.51 | v61.43,72.94 62.59,71.77 arc45 64.39,71.03 v109.06,71.03
EN_A  (via drill 0.35)
  Top 0.406: v51.91,65.32 55.3,65.32 arc-45 57.1,64.57 MAIN_CONNECTOR.03
  Bottom 0.406: ARDUINO_MEGA.D23 49.33,66.06 arc45 51.13,65.32 v51.91,65.32
EN_B  (via drill 0.35)
  Top 0.406: v67.78,66.59 72.75,61.61 arc-45 73.5,59.82 MAIN_CONNECTOR.11
  Bottom 0.406: ARDUINO_MEGA.D31 58.22,67.33 arc45 60.02,66.59 v67.78,66.59
EN_C
  Top 0.406: ARDUINO_MEGA.D35 42.71,93.89 42.74,93.86 42.74,92.68 arc45 43.48,90.89 45.07,89.3 arc45 46.86,88.56 59.88,88.56 arc-45 62.14,87.62 arc-45 62.7,86.27 62.7,81.83 | 62.7,81.83 arc45 62.7,81.83 | 62.7,81.83 arc45 62.89,81.38 63.84,80.42 arc-45 64.73,78.27 64.73,74.84 arc45 65.46,73.09 66.25,72.3 arc45 67.78,71.67 68,71.67 arc-45 70.25,70.74 81.12,59.86 arc45 81.75,59.6 arc-45 82.84,59.15 MAIN_CONNECTOR.19
EN_D
  Top 0.406: ARDUINO_MEGA.D41 51.8,99.15 arc-45 52.54,97.36 52.54,93.26 arc45 53.36,91.27 53.55,91.09 arc45 55.06,90.46 60.63,90.46 arc-45 63.33,89.35 63.6,89.07 arc-45 64.61,86.64 64.61,85.42 arc45 65.72,82.72 66.57,81.88 66.88,81.56 69.14,79.31 arc-45 70.07,77.06 70.07,74.33 arc45 70.44,73.43 81.63,62.25 arc45 83.42,61.51 89.59,61.51 arc-45 91.39,60.76 MAIN_CONNECTOR.27
GND  (via drill 0.35)
  Top 0.406: RESET.4 RESET.3 | START.4 START.3
  Top 1.27: MAIN_CONNECTOR.28 MAIN_CONNECTOR.30 MAIN_CONNECTOR.32 MAIN_CONNECTOR.34 MAIN_CONNECTOR.36 MAIN_CONNECTOR.38 MAIN_CONNECTOR.40
  Bottom 0.406: C4.2 v82.39,108.11
  pour Bottom (no thermals): -11.59,168.82 -11.59,-19.77 154.78,-19.77 188.43,-19.77 188.43,145.33 188.43,168.82
  pour Top (no thermals): -11.59,168.82 -11.59,-19.77 188.43,-19.77 188.43,168.82
GYRO_SCL  (via drill 0.35 pad 0.8)
  Top 0.406: v81.75,87.54 81.75,90.08 | 81.75,90.08 U1.5 | MPU-6050.3 88.74,87.54 86.2,90.08 81.75,90.08
  Bottom 0.406: ARDUINO_MEGA.D21 45.7,68.05 arc45 46.45,69.85 46.45,70.27 arc-45 46.92,71.4 arc1 52.75,71.43 arc12 57.41,72.89 arc21 62.61,76.36 arc5 67.15,81.19 73.5,87.54 v81.75,87.54 | MPU-6050.3 88.74,83.73 arc90 90.01,82.46 arc-31 104.3,78.56 arc-64 117.95,52.57 arc62 119.22,50.08 arc-63 121.12,46.27 arc-80 119.22,44.36 arc-100 DISPLAY.3
GYRO_SDA
  Bottom 0.406: ARDUINO_MEGA.D20 arc-45 45.75,71.35 46.45,72.05 52.67,72.05 arc12 57.09,73.43 arc21 62.17,76.82 arc5 66.67,81.6 73.87,88.81 81.12,88.81 83.02,90.72 | DISPLAY.4 arc-45 117.31,52.62 arc64 103.98,78.02 arc31 90.01,81.83 88.74,81.83 arc-90 86.2,84.37 MPU-6050.4 86.2,87.54 83.02,90.72 | U1.4 84.29,91.99 83.02,90.72
I0  (via drill 0.35 pad 0.8)
  Top 0.406: v75.4,113.58 75.4,114.85 76.04,115.48 R12.1 C16.1
  Bottom 0.406: ARDUINO_MEGA.A10 32.55,105.01 41.49,113.96 75.02,113.96 v75.4,113.58
I1
  Top 0.406: ARDUINO_MEGA.A8 30.01,105.01 36.77,111.77 76.89,111.77 77.43,112.31 92.27,112.31 92.72,111.86 100.99,111.86 103.98,114.85 R18.1 C18.1
IN1  (via drill 0.3 pad 0.8)
  Top 0.406: v32.86,65.03 32.86,58.75 arc45 33.6,56.95 36.56,53.99 arc45 41.42,51.98 67.66,51.98 v68.04,52.36 | JP1.2 110.11,76.75 arc45 108.31,76 107.79,75.48 107.79,67.48 arc45 108.42,65.95 110.22,64.15 arc-45 111.6,60.83 111.6,54.77 110.65,53.83 arc-45 106.52,52.12 75.27,52.12 74.77,52.62 v74.64,52.62
  Bottom 0.406: ARDUINO_MEGA.D11 32.55,65.77 arc45 v32.86,65.03 | v74.64,52.62 74.39,52.36 v68.04,52.36
IN1_A  (via drill 0.35)
  Top 0.406: ARDUINO_MEGA.D25 51.24,66.69 arc45 53.03,65.95 55.94,65.95 arc-45 57.73,65.21 62.25,60.68 arc45 v63.34,60.24
  Bottom 0.406: v63.34,60.24 arc-45 64.42,59.79 MAIN_CONNECTOR.05
IN1_B  (via drill 0.35)
  Top 0.406: MAIN_CONNECTOR.13 arc45 75.32,60.06 v70.07,65.32
  Bottom 0.406: ARDUINO_MEGA.D29 56.32,66.69 arc45 58.11,65.95 68.54,65.95 arc-45 v70.07,65.32
IN1_C
  Top 0.406: ARDUINO_MEGA.D37 47.14,98.73 arc45 48.1,98.34 49.1,98.34 arc-45 50.64,97.7 arc-45 51.27,96.17 51.27,93.26 arc45 52.47,90.38 52.65,90.19 arc45 55.06,89.19 60.63,89.19 arc-45 62.43,88.45 62.7,88.18 arc-45 63.34,86.64 63.34,84.15 | 63.34,84.15 arc-45 63.34,84.15 | 63.34,84.15 63.34,81.83 64.29,80.87 arc-45 65.37,78.27 65.37,74.84 arc45 65.91,73.54 66.7,72.75 arc45 67.78,72.3 68,72.3 arc-45 70.69,71.18 81.12,60.76 arc45 82.39,60.24 83.24,60.24 arc-45 85.04,59.49 MAIN_CONNECTOR.21
IN1_D
  Top 0.406: ARDUINO_MEGA.D43 arc-45 53.18,99.88 53.18,93.26 arc45 53.81,91.72 54,91.54 arc45 55.06,91.1 60.63,91.1 arc-45 63.78,89.79 64.05,89.52 arc-45 65.24,86.64 65.24,85.42 arc45 66.17,83.17 69.59,79.76 arc-45 70.7,77.06 70.7,74.33 arc45 70.89,73.88 81.89,62.88 arc45 83.68,62.14 91.5,62.14 arc-45 93.29,61.4 MAIN_CONNECTOR.29
IN2  (via drill 0.3 pad 0.8)
  Top 0.406: ARDUINO_MEGA.D12 35.09,74.25 arc-45 39.28,75.98 v48.35,75.98 | v53.43,73.7 53.81,74.08 55.22,74.08 arc-45 59.43,72.33 59.4,72.3 v60.29,72.3 | v109.69,69.76 v114.77,69.76
  Bottom 0.406: v48.35,75.98 49.77,74.56 arc45 50.64,74.21 50.8,74.04 arc45 51.63,73.7 v53.43,73.7 | v60.29,72.3 62,70.59 arc45 64.01,69.76 v109.69,69.76 | v114.77,69.76 114.15,70.38 arc-45 113.88,71.03 113.88,79.29 JP1.3
IN2_A  (via drill 0.35)
  Top 0.406: MAIN_CONNECTOR.07 68.42,63.84 arc45 v67.91,65.06
  Bottom 0.406: ARDUINO_MEGA.D27 54.41,66.06 arc45 56.82,65.06 v67.91,65.06
IN2_B
  Top 0.406: ARDUINO_MEGA.D33 41.38,99.41 arc-45 42.13,97.61 42.13,93.28 42.1,93.26 42.1,92.68 arc45 43.03,90.44 44.62,88.85 arc45 46.86,87.92 59.88,87.92 arc-45 61.7,87.17 arc-45 62.07,86.27 62.07,81.83 | 62.07,81.83 arc45 62.07,81.83 | 62.07,81.83 arc45 62.44,80.93 63.39,79.97 arc-45 64.1,78.27 64.1,74.84 arc45 65.01,72.64 65.8,71.85 arc45 67.78,71.03 68,71.03 arc-45 69.8,70.29 77.83,62.25 arc-45 78.58,60.45 MAIN_CONNECTOR.15
IN2_C
  Top 0.406: ARDUINO_MEGA.D39 49.04,99.37 arc45 50,98.97 arc-45 51.09,98.52 51.27,98.34 arc-45 51.91,96.8 51.91,93.26 arc45 52.91,90.82 53.1,90.64 arc45 55.06,89.83 60.63,89.83 arc-45 62.88,88.9 63.15,88.62 arc-45 63.97,86.64 63.97,85.42 arc45 65.27,82.27 68.69,78.86 arc-45 69.43,77.06 69.43,74.33 arc45 69.99,72.99 81.36,61.61 arc45 83.16,60.87 85.15,60.87 arc-45 86.94,60.13 MAIN_CONNECTOR.23
IN2_D
  Top 0.406: ARDUINO_MEGA.D45 54.56,99.77 arc45 53.81,97.97 53.81,93.26 arc45 54.26,92.17 54.45,91.99 arc45 55.06,91.73 60.63,91.73 arc-45 64.23,90.24 64.5,89.97 arc-45 65.88,86.64 65.88,85.42 arc45 66.62,83.62 70.04,80.21 arc-45 71.34,77.06 71.34,74.33 77.88,67.79 78.2,67.47 82.15,63.52 arc45 83.95,62.78 93.4,62.78 arc-45 95.2,62.03 MAIN_CONNECTOR.31
IN3  (via drill 0.35 pad 0.8)
  Top 0.406: JP1.4 112.74,81.83 108.04,77.13 107.15,76.24 107.15,76.11 107.15,66.2 107.91,65.44 107.91,64.17 107.91,62.65 110.84,59.73 110.84,55.17 109.69,54.02 109.42,53.75 107.38,52.91 84.64,52.91 84.29,53.25 75.4,53.25 v74.77,53.89 | v68.42,53.89 67.15,53.89 66.51,53.25 59.53,53.25 52.54,53.25 39.21,53.25 35.14,57.31 v35.14,65.06
  Bottom 0.406: v74.77,53.89 v68.42,53.89 | v35.14,65.06 35.14,67.55 ARDUINO_MEGA.D13
IN4  (via drill 0.3 pad 0.8)
  Top 0.406: ARDUINO_MEGA.D14 37.63,72.01 arc-45 38.07,73.06 38.57,73.57 arc-45 40.11,74.21 v48.1,74.21 | v54.36,73.3 55.31,73.3 arc-45 58.64,71.92 59.53,71.03 v60.16,71.03 | v110.33,68.49 114.99,68.49 arc45 116.79,69.23 120.49,72.94 arc45 121.12,74.47 v121.12,83.73 | v118.58,84.37 JP1.5
  Bottom 0.406: v48.1,74.21 48.92,73.38 arc45 50,72.94 53.48,72.94 arc45 v54.36,73.3 | v60.16,71.03 61.96,69.23 arc45 63.75,68.49 v110.33,68.49 | v121.12,83.73 120.49,84.37 v118.58,84.37
IR_READ_A
  Bottom 0.406: ARDUINO_MEGA.A12 arc-90 37.25,105.32 64.61,105.32 arc-90 65.88,104.05 arc90 66.51,103.42 69.05,103.42 71.59,103.42 arc90 TSOP_0.4
IR_READ_B  (via drill 0.35)
  Top 0.406: TSOP_1.4 arc-90 v98.9,102.78
  Bottom 0.406: ARDUINO_MEGA.A14 arc-90 39.15,104.69 64.61,104.69 arc-90 65.24,104.05 arc90 66.51,102.78 v98.9,102.78
KICK+
  Bottom 3: U$3.P$2 141.54,64.14 135.73,58.33 135.73,49 U$9.P$2
KICK-
  Bottom 3: U$10.P$2 129.47,58.43 135.82,64.78 U$4.P$2
KICKER
  Bottom 0.406: MAIN_CONNECTOR.01 57.73,61.4 arc45 56.86,61.76 25.15,61.76 arc-45 22.06,63.04 arc-45 21.05,65.48 21.05,70.06 arc-45 21.48,71.1 arc-45 22.22,71.41 23.08,71.41 arc-45 24.07,71 ARDUINO_MEGA.D4
LED_ENABLE
  Bottom 0.406: MAIN_CONNECTOR.08 67.64,55.01 arc-45 65.84,54.27 60.8,54.27 arc-45 59.06,54.98 53.29,60.76 arc45 52.41,61.12 24.67,61.12 arc-45 20.04,63.04 arc-45 18.51,66.75 18.51,69.89 arc-45 18.96,70.97 19.29,71.3 arc-45 21.08,72.05 24.95,72.05 arc-45 26.74,71.3 27.16,70.88 arc-45 ARDUINO_MEGA.D6
LED_UP
  Top 0.406: TSOP_0.6 72.12,104.16 arc45 73.91,103.42 95.94,103.42 arc45 97.74,104.16 TSOP_1.6
LIGHT_READ_A
  Top 0.406: ARDUINO_MEGA.A13 36.5,99.21 arc45 38.3,98.46 39.07,98.46 arc-45 40.6,97.83 arc-45 40.86,97.21 40.86,93.89 40.83,93.86 40.83,92.68 arc45 42.13,89.54 43.72,87.95 arc45 46.86,86.65 59.88,86.65 arc-45 60.8,86.27 60.8,81.98 arc45 61.73,79.72 62.49,78.96 arc-45 62.83,78.14 62.83,63.37 arc45 63.34,62.14 63.86,61.61 arc-45 64.61,59.82 64.61,58.11 arc-45 63.86,56.32 MAIN_CONNECTOR.04
LIGHT_READ_B
  Top 0.406: ARDUINO_MEGA.A15 38.88,99.37 arc45 39.84,98.97 arc-45 40.93,98.52 41.11,98.34 arc-45 41.49,97.42 41.49,93.89 41.47,93.86 41.47,92.68 arc45 42.58,89.99 44.17,88.4 arc45 46.86,87.29 59.88,87.29 arc-45 61.25,86.72 arc-45 61.43,86.27 61.43,81.99 arc45 62.18,80.19 62.95,79.42 arc-45 63.48,78.14 63.48,69.13 63.48,68.49 63.48,64.32 arc45 64.22,62.53 66.4,60.34 arc-45 67.15,58.55 67.15,58.11 arc-45 66.4,56.32 MAIN_CONNECTOR.06
LIGHT_SET_0  (via drill 0.35)
  Top 0.406: TSOP_0.3 74.66,109.02 arc-45 76.45,109.77 98.48,109.77 arc-45 99.19,109.47 100.8,107.86 TSOP_1.3 arc90 102.71,106.59 104.61,106.59 arc-90 105.88,105.32 v105.88,102.78 105.88,77.99 105.17,77.28 105.17,65.41 105.76,64.83 105.76,60.11 arc-90 MAIN_CONNECTOR.35 | ARDUINO_MEGA.D28 arc90 54.14,71.41 53.3,71.41 arc-90 52.54,72.17 52.54,73.57 arc-90 55.08,76.11 59.89,76.11 arc90 v62.18,78.4
  Bottom 0.406: v62.18,78.4 62.18,97.07 arc-90 65.23,100.11 103.22,100.11 arc90 v105.88,102.78
LIGHT_SET_1  (via drill 0.35)
  Top 0.406: v100.56,109.06 arc-90 101.9,110.4 104.61,110.4 arc-90 106.52,108.5 v106.52,103.42 106.52,77.75 105.83,77.06 105.83,65.64 106.52,64.95 MAIN_CONNECTOR.37 | ARDUINO_MEGA.D26 arc-90 51.91,71.1 51.91,73.57 arc-90 55.08,76.75 59.64,76.75 arc90 v61.29,78.4
  Bottom 0.406: TSOP_0.5 71.48,107.33 arc45 73.28,106.59 82.13,106.59 arc90 82.51,106.97 arc-90 83.02,107.48 86.45,107.48 arc-90 86.83,107.1 arc90 87.34,106.59 96.58,106.59 arc45 98.37,107.33 TSOP_1.5 arc-90 100.09,109.06 v100.56,109.06 | v61.29,78.4 61.29,97.07 arc-90 65.01,100.78 103.24,100.78 arc90 105.25,102.78 arc-90 105.88,103.42 v106.52,103.42
LIGHT_SET_2  (via drill 0.35)
  Top 0.406: TSOP_1.7 95.83,107.33 arc-45 94.04,106.59 87.34,106.59 arc-90 86.83,107.1 arc90 86.45,107.48 83.02,107.48 arc90 82.51,106.97 arc-90 82.13,106.59 70.74,106.59 arc-45 68.94,107.33 TSOP_0.7 arc-90 70.96,110.4 99.3,110.4 arc45 99.91,110.65 100.06,110.8 arc-45 100.93,111.16 105.12,111.16 arc-90 107.15,109.13 v107.15,104.05 107.15,77.5 106.49,76.84 106.49,65.86 107.15,65.2 107.15,60.24 arc90 MAIN_CONNECTOR.39 | ARDUINO_MEGA.D24 arc90 51.27,71.08 51.27,73.57 arc-90 55.08,77.38 59.39,77.38 arc90 v60.41,78.4
  Bottom 0.406: v60.41,78.4 60.41,97.07 arc-90 64.79,101.44 103.27,101.44 arc90 104.61,102.78 arc-90 105.88,104.05 v107.15,104.05
LIGHT_SET_3  (via drill 0.35)
  Top 0.406: MAIN_CONNECTOR.02 60.58,55.79 arc-45 58.78,56.53 50.09,65.23 arc-45 49.11,67.59 49.11,67.68 arc45 48.31,69.62 ARDUINO_MEGA.D22 arc-90 48.93,71.28 49.24,71.28 arc90 50.64,72.68 50.64,73.57 arc-90 55.08,78.02 59.15,78.02 arc90 v59.53,78.4
  Bottom 0.406: TSOP_1.2 102.82,104.16 arc-45 101.02,103.42 100.8,103.42 | TSOP_0.2 77.2,104.16 arc45 78.99,103.42 100.8,103.42 | 100.8,103.42 arc-90 99.53,102.15 64.61,102.15 arc90 59.53,97.07 v59.53,78.4
N$1
  Top 2.54: FUSE.2 89.04,33.72 POWER_SWITCH.2
N$2
  Top 1.27: U$1.1 58.77,23.91 72.36,37.5 POWER_SWITCH.1
  Top 2.54: POWER_SWITCH.1 84.59,38.31 arc-9 J2.P
N$3
  Top 2.54: FUSE.1 90.68,39.4 J2.N
N$9
  Top 0.406: IR1.VS 68.42,122.47 R11.2
N$11
  Top 0.406: R17.2 96.36,123.1 IR2.VS
N$23
  Top 0.406: IR1.VO 76.04,123.74 R12.2 R13.2
N$27
  Top 0.406: IR2.VO 103.34,124.37 103.98,123.74 R18.2 R19.2
PWM_A
  Bottom 0.406: ARDUINO_MEGA.D3 22.39,65.32 arc90 25.31,62.39 66.38,62.39 arc-45 67.26,62.03 MAIN_CONNECTOR.09
PWM_B
  Bottom 0.406: ARDUINO_MEGA.D5 24.93,65.95 arc90 27.85,63.03 75.91,63.03 arc-45 76.78,62.67 MAIN_CONNECTOR.17
PWM_C
  Bottom 0.406: ARDUINO_MEGA.D7 27.47,66.59 arc90 30.39,63.66 85.43,63.66 arc-45 86.31,63.3 MAIN_CONNECTOR.25
PWM_D
  Bottom 0.406: ARDUINO_MEGA.D9 30.01,65.95 arc45 30.24,65.39 30.32,65.32 arc45 32.77,64.3 94.96,64.3 arc-45 95.83,63.94 MAIN_CONNECTOR.33
RESET_SWITCH  (via drill 0.35)
  Top 0.406: ARDUINO_MEGA.D2 22.84,69.69 arc-45 23.59,67.89 23.59,67.6 arc90 25.24,65.95 37.94,65.95 42.13,65.95 v54.19,53.89 | RESET.2 RESET.1 74.77,11.63 | 74.77,11.63 77.94,11.63 R6.1 | v74.77,14.52 74.77,11.63
  Bottom 0.406: v54.19,53.89 60.69,47.39 arc-45 61.43,45.59 61.43,35.25 arc45 62.18,33.46 74.02,21.61 arc-45 74.77,19.81 v74.77,14.52
START_SWITCH  (via drill 0.35)
  Top 0.406: 86.83,11.63 START.2 START.1 | 86.83,11.63 86.2,11.63 R7.1 | v84.93,11.34 86.83,11.63 | v56.35,53.93 45.44,64.84 arc45 44.29,65.32 43.21,66.39 arc-45 ARDUINO_MEGA.D19
  Bottom 0.406: v84.93,11.34 arc-70 82.77,11.34 76.55,17.56 76.55,19.86 arc45 75.29,22.88 64.08,34.09 arc-45 63.34,35.89 63.34,45.89 arc45 62.59,47.68 v56.35,53.93

### Text on the board
tNames: XLC-CAPTUR | 2024 | STELA